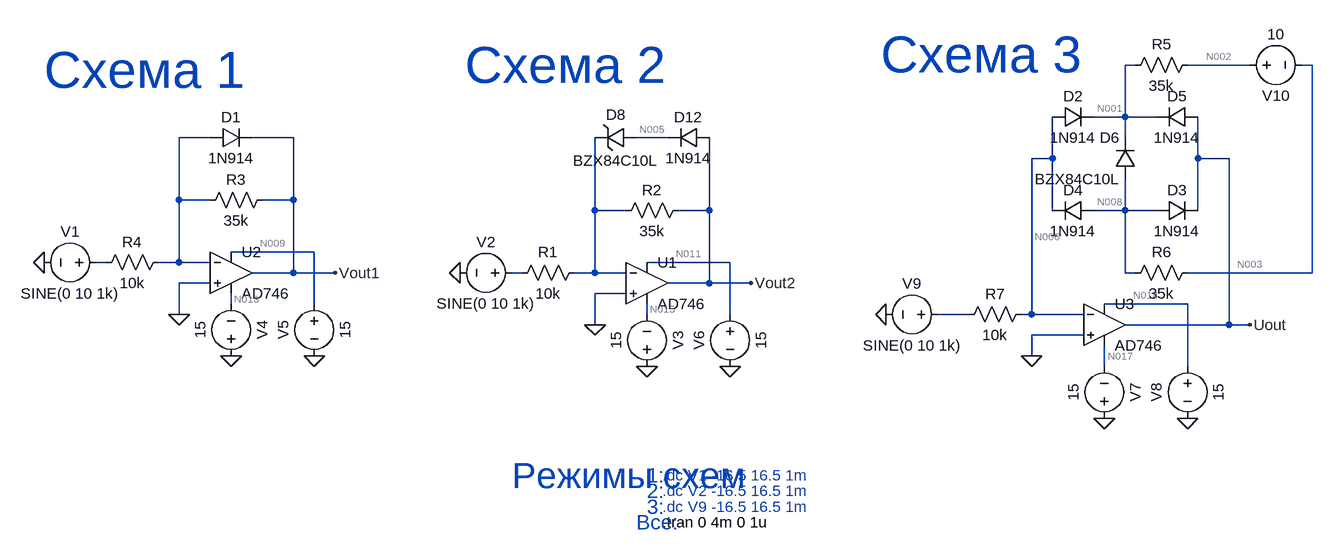
[diagram p0: schematic lab4.asc]
lab4.asc, the LTspice schematic file:
Version 4.1
SHEET 1 2420 1068
WIRE 1984 -272 1968 -272
WIRE 2160 -272 2064 -272
WIRE 2256 -272 2240 -272
WIRE 1968 -192 1968 -272
WIRE 1968 -192 1920 -192
WIRE 2016 -192 1968 -192
WIRE 560 -160 512 -160
WIRE 688 -160 624 -160
WIRE 1264 -160 1216 -160
WIRE 1968 -160 1968 -192
WIRE 1856 -128 1856 -192
WIRE 1856 -128 1824 -128
WIRE 2080 -128 2080 -192
WIRE 2128 -128 2080 -128
WIRE 512 -64 512 -160
WIRE 560 -64 512 -64
WIRE 688 -64 688 -160
WIRE 688 -64 640 -64
WIRE 1152 -48 1152 -160
WIRE 1200 -48 1152 -48
WIRE 1328 -48 1328 -160
WIRE 1328 -48 1280 -48
WIRE 1856 -48 1856 -128
WIRE 1968 -48 1968 -96
WIRE 1968 -48 1920 -48
WIRE 2016 -48 1968 -48
WIRE 2080 -48 2080 -128
WIRE 720 16 592 16
WIRE 400 32 384 32
WIRE 512 32 512 -64
WIRE 512 32 480 32
WIRE 560 32 512 32
WIRE 1360 32 1232 32
WIRE 688 48 688 -64
WIRE 688 48 624 48
WIRE 752 48 688 48
WIRE 1040 48 1024 48
WIRE 1152 48 1152 -48
WIRE 1152 48 1120 48
WIRE 1200 48 1152 48
WIRE 1968 48 1968 -48
WIRE 1984 48 1968 48
WIRE 2256 48 2256 -272
WIRE 2256 48 2064 48
WIRE 560 64 512 64
WIRE 1328 64 1328 -48
WIRE 1328 64 1264 64
WIRE 1392 64 1328 64
WIRE 1200 80 1152 80
WIRE 592 96 592 80
WIRE 720 96 720 16
WIRE 2064 96 1936 96
WIRE 512 112 512 64
WIRE 1232 112 1232 96
WIRE 1360 112 1360 32
WIRE 1728 112 1680 112
WIRE 1824 112 1824 -128
WIRE 1824 112 1808 112
WIRE 1904 112 1824 112
WIRE 1152 128 1152 80
WIRE 2128 128 2128 -128
WIRE 2128 128 1968 128
WIRE 2160 128 2128 128
WIRE 1904 144 1824 144
WIRE 1824 176 1824 144
WIRE 1936 192 1936 160
WIRE 2064 192 2064 96
FLAG 1152 128 0
FLAG 512 112 0
FLAG 944 48 0
FLAG 304 32 0
FLAG 752 48 Vout1
FLAG 1392 64 Vout2
FLAG 592 176 0
FLAG 720 176 0
FLAG 1232 192 0
FLAG 1360 192 0
FLAG 1824 176 0
FLAG 2160 128 Uout
FLAG 1936 272 0
FLAG 2064 272 0
FLAG 1600 112 0
SYMBOL OpAmps\\AD746 1232 0 R0
SYMATTR InstName U1
SYMBOL diode 1328 -176 R90
WINDOW 0 0 32 VBottom 2
WINDOW 3 32 32 VTop 2
SYMATTR InstName D12
SYMATTR Value 1N914
SYMBOL zener 1216 -176 R90
WINDOW 0 -4 32 VBottom 2
WINDOW 3 36 32 VTop 2
SYMATTR InstName D8
SYMATTR Value BZX84C10L
SYMBOL diode 560 -144 R270
WINDOW 0 32 32 VTop 2
WINDOW 3 0 32 VBottom 2
SYMATTR InstName D1
SYMATTR Value 1N914
SYMBOL res 1296 -64 R90
WINDOW 0 0 56 VBottom 2
WINDOW 3 32 56 VTop 2
SYMATTR InstName R2
SYMATTR Value 35k
SYMBOL res 1136 32 R90
WINDOW 0 0 56 VBottom 2
WINDOW 3 32 56 VTop 2
SYMATTR InstName R1
SYMATTR Value 10k
SYMBOL OpAmps\\AD746 592 -16 R0
SYMATTR InstName U2
SYMBOL res 656 -80 R90
WINDOW 0 0 56 VBottom 2
WINDOW 3 32 56 VTop 2
SYMATTR InstName R3
SYMATTR Value 35k
SYMBOL res 496 16 R90
WINDOW 0 0 56 VBottom 2
WINDOW 3 32 56 VTop 2
SYMATTR InstName R4
SYMATTR Value 10k
SYMBOL voltage 400 32 R90
WINDOW 0 -32 56 VBottom 2
WINDOW 3 32 56 VTop 2
WINDOW 123 0 0 Left 0
WINDOW 39 0 0 Left 0
SYMATTR InstName V1
SYMATTR Value SINE(0 10 1k)
SYMBOL voltage 1232 208 R180
WINDOW 0 -32 56 VBottom 2
WINDOW 3 32 56 VTop 2
WINDOW 123 0 0 Left 0
WINDOW 39 0 0 Left 0
SYMATTR InstName V3
SYMATTR Value 15
SYMBOL voltage 592 192 R180
WINDOW 0 -32 56 VBottom 2
WINDOW 3 32 56 VTop 2
WINDOW 123 0 0 Left 0
WINDOW 39 0 0 Left 0
SYMATTR InstName V4
SYMATTR Value 15
SYMBOL voltage 720 80 R0
WINDOW 0 -32 56 VBottom 2
WINDOW 3 32 56 VTop 2
WINDOW 123 0 0 Left 0
WINDOW 39 0 0 Left 0
SYMATTR InstName V5
SYMATTR Value 15
SYMBOL voltage 1360 96 R0
WINDOW 0 -32 56 VBottom 2
WINDOW 3 32 56 VTop 2
WINDOW 123 0 0 Left 0
WINDOW 39 0 0 Left 0
SYMATTR InstName V6
SYMATTR Value 15
SYMBOL voltage 1040 48 R90
WINDOW 0 -32 56 VBottom 2
WINDOW 3 32 56 VTop 2
WINDOW 123 0 0 Left 0
WINDOW 39 0 0 Left 0
SYMATTR InstName V2
SYMATTR Value SINE(0 10 1k)
SYMBOL OpAmps\\AD746 1936 64 R0
SYMATTR InstName U3
SYMBOL diode 1856 -176 R270
WINDOW 0 32 32 VTop 2
WINDOW 3 0 32 VBottom 2
SYMATTR InstName D2
SYMATTR Value 1N914
SYMBOL diode 2016 -32 R270
WINDOW 0 32 32 VTop 2
WINDOW 3 0 32 VBottom 2
SYMATTR InstName D3
SYMATTR Value 1N914
SYMBOL diode 1920 -64 R90
WINDOW 0 0 32 VBottom 2
WINDOW 3 32 32 VTop 2
SYMATTR InstName D4
SYMATTR Value 1N914
SYMBOL diode 2080 -208 R90
WINDOW 0 0 32 VBottom 2
WINDOW 3 32 32 VTop 2
SYMATTR InstName D5
SYMATTR Value 1N914
SYMBOL diode 1984 -96 R180
WINDOW 0 24 64 Left 2
WINDOW 3 24 0 Left 2
SYMATTR InstName D6
SYMATTR Value BZX84C10L
SYMATTR Description Diode
SYMATTR Type diode
SYMBOL res 2080 -288 R90
WINDOW 0 0 56 VBottom 2
WINDOW 3 32 56 VTop 2
SYMATTR InstName R5
SYMATTR Value 35k
SYMBOL res 2080 32 R90
WINDOW 0 0 56 VBottom 2
WINDOW 3 32 56 VTop 2
SYMATTR InstName R6
SYMATTR Value 35k
SYMBOL res 1824 96 R90
WINDOW 0 0 56 VBottom 2
WINDOW 3 32 56 VTop 2
SYMATTR InstName R7
SYMATTR Value 10k
SYMBOL voltage 1936 288 R180
WINDOW 0 -32 56 VBottom 2
WINDOW 3 32 56 VTop 2
WINDOW 123 0 0 Left 0
WINDOW 39 0 0 Left 0
SYMATTR InstName V7
SYMATTR Value 15
SYMBOL voltage 2064 176 R0
WINDOW 0 -32 56 VBottom 2
WINDOW 3 32 56 VTop 2
WINDOW 123 0 0 Left 0
WINDOW 39 0 0 Left 0
SYMATTR InstName V8
SYMATTR Value 15
SYMBOL voltage 1696 112 R90
WINDOW 0 -32 56 VBottom 2
WINDOW 3 32 56 VTop 2
WINDOW 123 0 0 Left 0
WINDOW 39 0 0 Left 0
SYMATTR InstName V9
SYMATTR Value SINE(0 10 1k)
SYMBOL voltage 2144 -272 R270
WINDOW 0 -32 56 VBottom 2
WINDOW 3 32 56 VTop 2
WINDOW 123 0 0 Left 0
WINDOW 39 0 0 Left 0
SYMATTR InstName V10
SYMATTR Value 10
TEXT 1256 384 Left 2 ;.dc V2 -16.5 16.5 1m
TEXT 1256 432 Left 2 !.tran 0 4m 0 1u
TEXT 1256 360 Left 2 ;.dc V1 -16.5 16.5 1m
TEXT 304 -264 Left 6 ;Схема 1
TEXT 952 -272 Left 6 ;Схема 2
TEXT 1024 360 Left 5 ;Режимы схем
TEXT 1592 -288 Left 6 ;Схема 3
TEXT 1256 408 Left 2 ;.dc V9 -16.5 16.5 1m
TEXT 1232 360 Left 3 ;1:
TEXT 1232 384 Left 3 ;2:
TEXT 1232 408 Left 3 ;3:
TEXT 1216 432 Left 3 ;Все:

The netlist it stands for:
* lab4.asc
X§U1 0 N007 N011 N015 Vout2 AD746  ; pins In+ In- V+ V- OUT
D12 Vout2 N005 1N914
D8 N005 N007 BZX84C10L
D1 N004 Vout1 1N914
R2 Vout2 N007 35k
R1 N007 N012 10k
X§U2 0 N004 N009 N013 Vout1 AD746  ; pins In+ In- V+ V- OUT
R3 Vout1 N004 35k
R4 N004 N010 10k
V1 N010 0 SINE(0 10 1k)
V3 0 N015 15
V4 0 N013 15
V5 N009 0 15
V6 N011 0 15
V2 N012 0 SINE(0 10 1k)
X§U3 0 N006 N014 N017 Uout AD746  ; pins In+ In- V+ V- OUT
D2 N006 N001 1N914
D3 N008 Uout 1N914
D4 N008 N006 1N914
D5 Uout N001 1N914
D6 N008 N001 BZX84C10L
R5 N002 N001 35k
R6 N003 N008 35k
R7 N006 N016 10k
V7 0 N017 15
V8 N014 0 15
V9 N016 0 SINE(0 10 1k)
V10 N002 N003 10
.model D D
.lib standard.dio
* .dc V2 -16.5 16.5 1m
.tran 0 4m 0 1u
* .dc V1 -16.5 16.5 1m
* Схема 1
* Схема 2
* Режимы схем
* Схема 3
* .dc V9 -16.5 16.5 1m
* 1:
* 2:
* 3:
* Все:
.backanno
.end

* Results of the author's LTspice run, read from the files saved beside the schematic
* Operating Point, zero values left out:
*   V(n001) = 4.895 V
*   V(n002) = 5.201 V
*   V(n003) = -4.799 V
*   V(n005) = 2.715 µV
*   V(n006) = -1.096 µV
*   V(n008) = -4.492 V
*   V(n009) = 15 V
*   V(n011) = 15 V
*   V(n013) = -15 V
*   V(n014) = 15 V
*   V(n015) = -15 V
*   V(n017) = -15 V
*   V(uout) = 401 mV
*   V(vout1) = 3.842 µV
*   V(vout2) = 3.848 µV
*   I(D2) = -2.525 nA
*   I(D3) = -2.525 nA
*   I(D4) = -2.524 nA
*   I(D5) = -2.524 nA
*   I(D6) = -8.75 µA
*   I(R2) = 109.9 pA
*   I(R3) = 109.8 pA
*   I(R5) = 8.755 µA
*   I(R6) = -8.755 µA
*   I(R7) = -109.6 pA
*   I(V10) = -8.755 µA
*   I(V3) = -4.899 mA
*   I(V4) = -4.899 mA
*   I(V5) = -4.899 mA
*   I(V6) = -4.899 mA
*   I(V7) = -4.899 mA
*   I(V8) = -4.899 mA
*   I(V9) = -109.6 pA
*   Ix(u1:1) = 110 pA
*   Ix(u1:2) = 110 pA
*   Ix(u1:3) = 4.899 mA
*   Ix(u1:4) = -4.899 mA
*   Ix(u1:5) = -110 pA
*   Ix(u2:1) = 110 pA
*   Ix(u2:2) = 110 pA
*   Ix(u2:3) = 4.899 mA
*   Ix(u2:4) = -4.899 mA
*   Ix(u2:5) = -110 pA
*   Ix(u3:1) = 110 pA
*   Ix(u3:2) = 110 pA
*   Ix(u3:3) = 4.899 mA
*   Ix(u3:4) = -4.899 mA
*   Ix(u3:5) = -1.201 pA
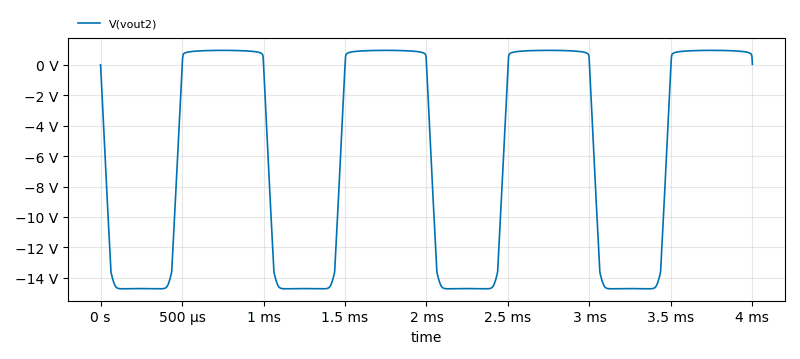
[diagram p1: Transient Analysis of lab4.asc, plotted from the saved traces]
* Transient Analysis, 1 run:
*   V(vout2): min -14.73 V, max 953.8 mV, average -5.883 V, rms 9.394 V, last 38.84 mV